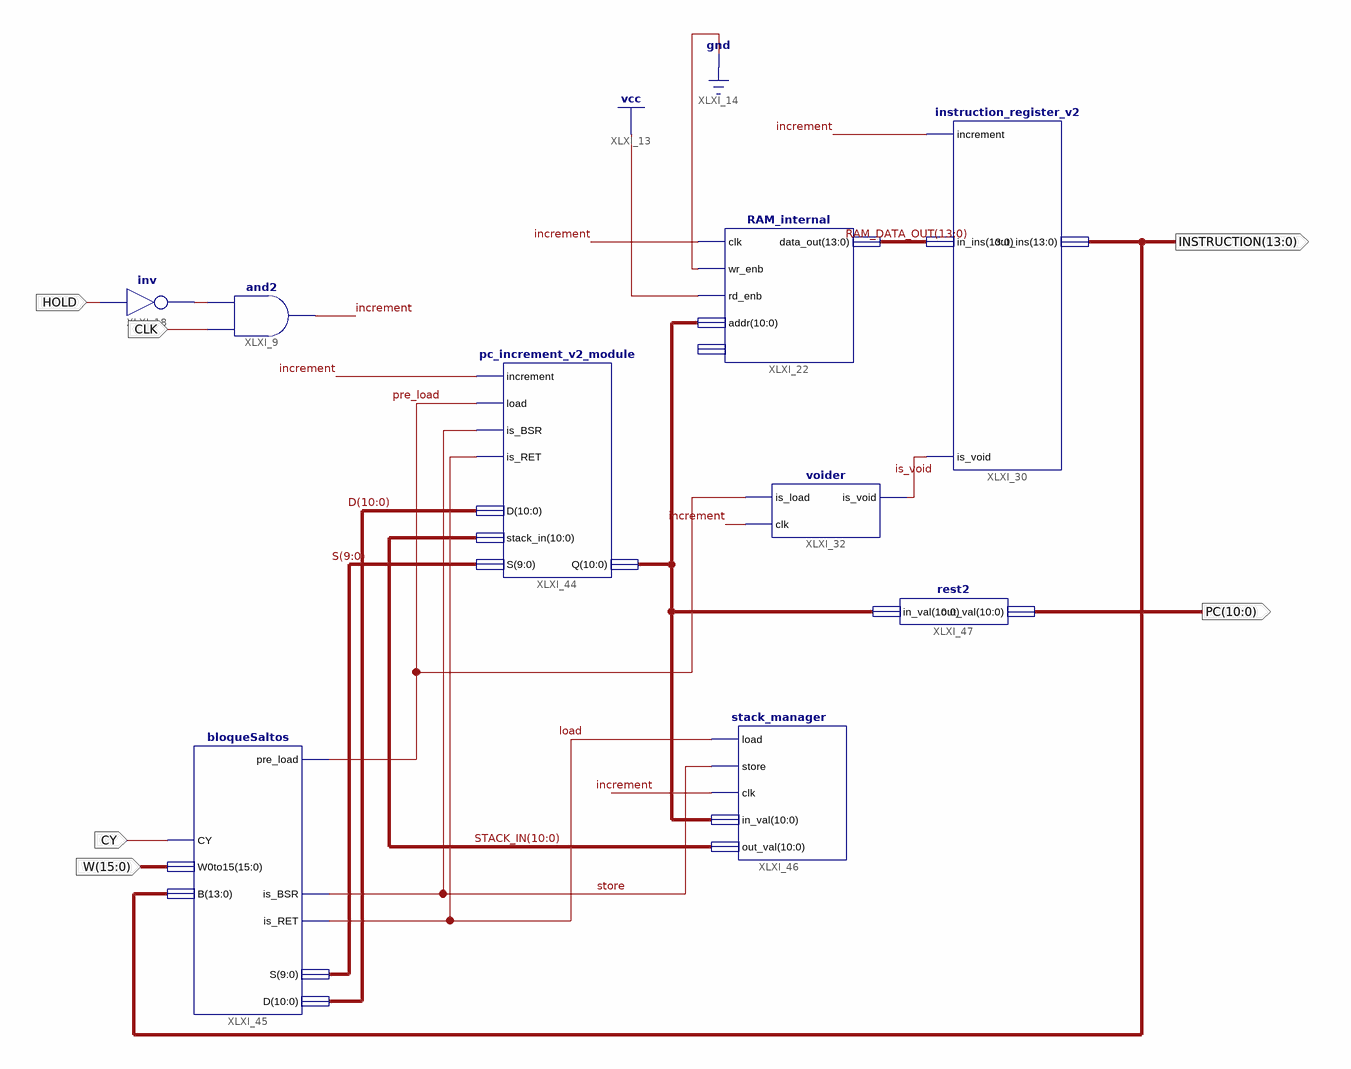
[diagram p0: schematic sheet 1]
// Xilinx ISE schematic unionMagica.sch (artix7) as structural Verilog: 9 symbols, 7 ports
module unionMagica (
  input  CY,
  input  CLK,
  input  HOLD,
  input  [15:0] W,
  output [13:0] INSTRUCTION,
  output increment,
  output [10:0] PC
);

  wire is_void, load, pre_load, store, XLXN_79;
  wire [9:0] S;
  wire [10:0] D, STACK_IN, XLXN_146;
  wire [13:0] RAM_DATA_OUT;

  and XLXI_9 (increment, CLK, XLXN_79);
  not XLXI_18 (XLXN_79, HOLD);
  RAM_internal XLXI_22 (
    .clk(increment), .wr_enb(1'b0), .rd_enb(1'b1), .addr(XLXN_146), .data_out(RAM_DATA_OUT));  // open: data_in
  instruction_register_v2 XLXI_30 (
    .increment(increment), .is_void(is_void), .in_ins(RAM_DATA_OUT), .out_ins(INSTRUCTION));
  voider XLXI_32 (.is_load(pre_load), .clk(increment), .is_void(is_void));
  pc_increment_v2_module XLXI_44 (
    .increment(increment), .load(pre_load), .is_BSR(store), .is_RET(load), .D(D), .stack_in(STACK_IN), .S(S),
    .Q(XLXN_146));
  bloqueSaltos XLXI_45 (
    .CY(CY), .W0to15(W), .B(INSTRUCTION), .pre_load(pre_load), .is_BSR(store), .is_RET(load), .S(S), .D(D));
  stack_manager XLXI_46 (.load(load), .store(store), .clk(increment), .in_val(XLXN_146), .out_val(STACK_IN));
  rest2 XLXI_47 (.in_val(XLXN_146), .out_val(PC));
endmodule
